# EAGLE schematic BusBreakout_I2C_Mini (EAGLE 9.4.2)
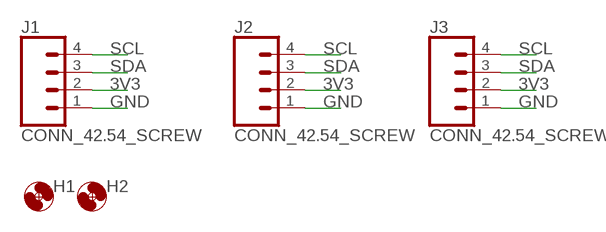
[diagram p0: schematic, sheet 1]

## Parts
H1  MOUNTING_HOLE4_NP  [4_40]
H2  MOUNTING_HOLE4_NP  [4_40]
J1  CONN_42.54_SCREW  [1X04_SCREW]
J2  CONN_42.54_SCREW  [1X04_SCREW]
J3  CONN_42.54_SCREW  [1X04_SCREW]

## Nets
3V3: J1.2 J2.2 J3.2
GND: J1.1 J2.1 J3.1
SCL: J1.4 J2.4 J3.4
SDA: J1.3 J2.3 J3.3

## Library data of the parts
H1 H2 = bschulz:MOUNTING_HOLE: Genaric Mechanical Mounting Hole Hole diameter based on max body diameter + 15% Keepout ring is for diameter of socket cap screw (minimum required clearance) TPlace ring is for diameter of pan head screw (recomended clearance) Specifications: Socket Cap <http://fastener-express.com/fastener-technical/SocketscapSS-Alloy.pdf> Button Head Socket Cap <http://fastener-express.com/fastener-technical/Button-Socket-alloy.pdf> Pan Head <http://fastener-express.com/fastener-technical/pan-machine-Screws.pdf>; DIGIKEY: DNP; MF: N/A; MPN: DNP
J1-J3 = bschulz:CONN_4: Genaric 4 terminal header Digikey 2.54_SCREW <https://www.digikey.com/product-detail/en/on-shore-technology-inc/OSTVN04A150/ED10563-ND/1588864>; DIGIKEY: ED10563-ND; MF: On Shore; MPN: OSTVN04A150